# Altium project SmartBuoyLoRa.PrjPCB
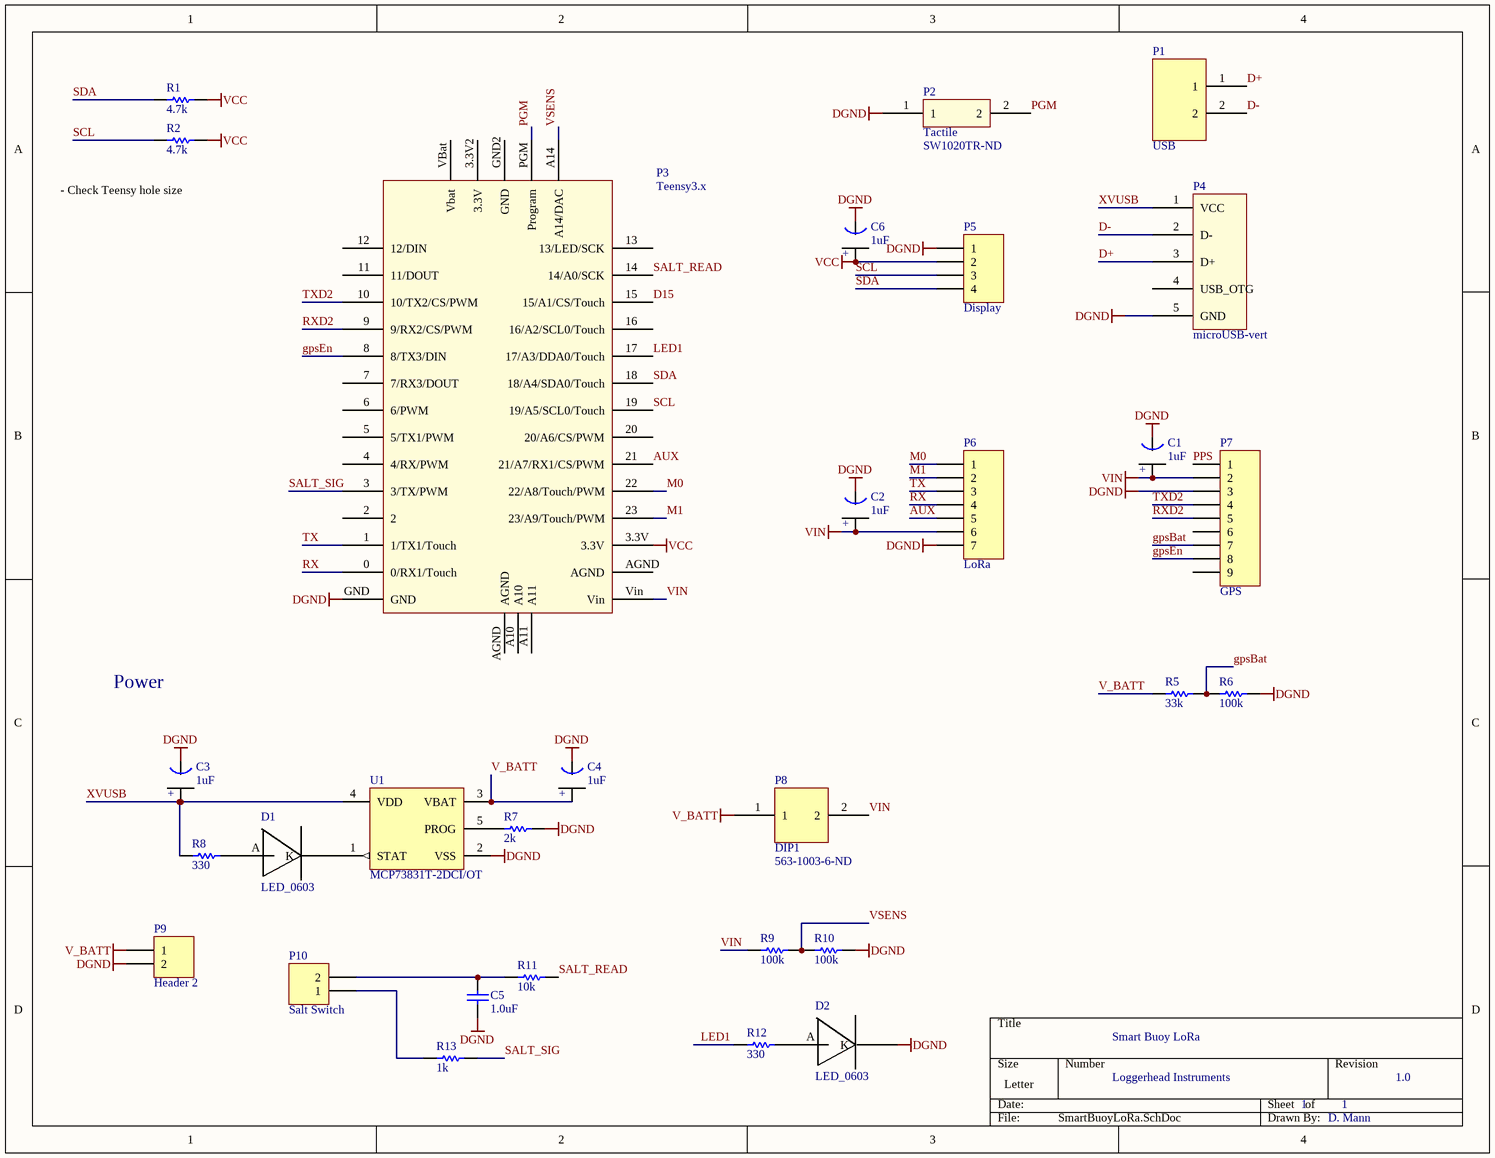
[diagram p0: SmartBuoyLoRa.SchDoc]
1 sheet, 30 parts. Net scope: global (net labels, ports and power ports of the same name join across sheets).
Board file: SmartBuoyLoRa.PcbDoc

## Sheet SmartBuoyLoRa.SchDoc
size Letter

### Parts
C1  1uF  [Tant0805]
C2  1uF  [Tant0805]
C3  1uF  [Tant0805]
C4  1uF  [Tant0805]
C5  1.0uF  [0402]
C6  1uF  [Tant0805]
D1  LED_0603  [Diode0603]
D2  LED_0603  [Diode0603]
P1  USB  [HDR_2x1_2mm]
P2  Tactile  Supplier Part Number 1: SW1020TR-ND  [Tactile-B3U-1000]
P3  Teensy3.x  [Teensy3.x]
P4  microUSB-vert  [MICROUSB-VERT]
P5  Display  [HDR1X4]
P6  LoRa  [HDR1X7]
P7  GPS  [HDR1X9]
P8  DIP1  Supplier Part Number 1: 563-1003-6-ND  [DIP1]
P9  Header 2  [HDR1X2]
P10  Salt Switch  [HDR1X2]
R1  4.7k  [3-0603]
R2  4.7k  [3-0603]
R5  33k  [3-0603]
R6  100k  [3-0603]
R7  2k  [3-0603]
R8  330  [3-0603]
R9  100k  [3-0603]
R10  100k  [3-0603]
R11  10k  [3-0603]
R12  330  [3-0603]
R13  1k  [3-0603]
U1  MCP73831T-2DCI/OT  [SOT-23-OT5_N]

### Nets
DGND: C1.1(GND) C2.1(GND) C3.1(GND) C4.1(GND) C5.2 C6.1(GND) D2.K P2.1 P3.GND P4.5(GND) P5.1 P6.7 P7.3 P9.2 R6.1 R7.1 R10.1 U1.2(VSS)
V_BATT: C4.2(+) P8.1 P9.1 R5.2 U1.3(VBAT)
VCC: C6.2(+) P3.3.3V P5.2 R1.1 R2.2
VIN: C1.2(+) C2.2(+) P3.Vin P6.6 P7.2 P8.2 R9.2
AUX: P3.21(21/A7/RX1/CS/PWM) P6.5
D15: P3.15(15/A1/CS/Touch)
D+: P1.1 P4.3(D+)
D-: P1.2 P4.2(D-)
gpsBat: P7.7 R5.1 R6.2
gpsEn: P3.8(8/TX3/DIN) P7.8
LED1: P3.17(17/A3/DDA0/Touch) R12.1
M0: P3.22(22/A8/Touch/PWM) P6.1
M1: P3.23(23/A9/Touch/PWM) P6.2
PGM: P2.2 P3.PGM(Program)
PPS: P7.1
RX: P3.0(0/RX1/Touch) P6.4
RXD2: P3.9(9/RX2/CS/PWM) P7.5
SALT_READ: P3.14(14/A0/SCK) R11.1
SALT_SIG: P3.3(3/TX/PWM) R13.2
SCL: P3.19(19/A5/SCL0/Touch) P5.3 R2.1
SDA: P3.18(18/A4/SDA0/Touch) P5.4 R1.2
TX: P3.1(1/TX1/Touch) P6.3
TXD2: P3.10(10/TX2/CS/PWM) P7.4
VSENS: P3.A14(A14/DAC) R9.1 R10.2
XVUSB: C3.2(+) P4.1(VCC) R8.1 U1.4(VDD)
NetC5_1: C5.1 P10.2 R11.2
NetD1_A: D1.A R8.2
NetD1_K: D1.K U1.1(STAT)
NetD2_A: D2.A R12.2
NetP10_1: P10.1 R13.1
NetR7_2: R7.2 U1.5(PROG)

Not connected (* = marked no-connect by the designer): P3 2 3.3V2(3.3V) 4(4/RX/PWM) 5(5/TX1/PWM) 6(6/PWM) 7(7/RX3/DOUT) 11(11/DOUT) 12(12/DIN) 13(13/LED/SCK) 16(16/A2/SCL0/Touch) 20(20/A6/CS/PWM) A10 A11 AGND GND2(GND) VBat(Vbat); P4 4(USB_OTG); P7 6 9

### Notes on the sheet
- (near R2) - Check Teensy hole size
- Power
- Smart Buoy LoRa
- Loggerhead Instruments
- 1
- 1.0
- D. Mann

### Library data of the parts
C1-C4 C6 = Tant0805: Value: 1uF
C5 = C0402: Ceramic Chip Capacitor - Standard; Note: Footprint corresponds to dimensions for bulk cassette packaging. This case size has tightened tolerances.; Value: 0.1uF; Published: 17-Jul-2002; LatestRevisionDate: 19-Mar-2004; LatestRevisionNote: Silkscreen size reduced.; DatasheetDocument: Mar-2001; PackageDocument: Mar-2001; PackageReference: 0402; Publisher: Altium Limited; Code_JEITA: 0402; Code_IPC: 1005 [0402]; ComponentLink1Description: Manufacturer Link; ComponentLink1URL: http://www.kemet.com/; ComponentLink2Description: Datasheet; ComponentLink2URL: http://www.kemet.com/kemet/web/homepage/kechome.nsf/vapubfilesname/F3102TA.pdf/$file/F3102TA.pdf
P1 = HDR_2x1_2mm: Charging Connector
P2 = Tactile_B3U-1000: Supplier 1: Digi-Key
P4 = microUSB-vert: Molex 105133-0011
P5 = Header 4: Header, 4-Pin; LatestRevisionDate: 17-Jul-2002; LatestRevisionNote: Re-released for DXP Platform.; Publisher: Altium Limited
P6 = Header 7: Header, 7-Pin; LatestRevisionDate: 17-Jul-2002; LatestRevisionNote: Re-released for DXP Platform.; Publisher: Altium Limited
P7 = Header 9: Header, 9-Pin; LatestRevisionDate: 17-Jul-2002; LatestRevisionNote: Re-released for DXP Platform.; Publisher: Altium Limited
P9 P10 = Header 2: Header, 2-Pin; LatestRevisionDate: 17-Jul-2002; LatestRevisionNote: Re-released for DXP Platform.; Publisher: Altium Limited
R1 R2 R5-R13 = ERJ3RK: Precision Thick Film Chip Resistor, 10 Ohm to 1M Ohm Range, 1% and 0.5% Tolerance, 0603 Size, 0.063 W; Published: 17-Dec-2003; LatestRevisionDate: 19-Mar-2004; LatestRevisionNote: Silkscreen size reduced.; PackageDocument: Mar-2003; PackageReference: 3-0603; Publisher: Altium Limited; Code_IPC: 1608 [0603]; ComponentLink1Description: Manufacturer Link; ComponentLink1URL: http://www.panasonic.com/industrial/components/resistive_products.htm; ComponentLink2Description: Datasheet; ComponentLink2URL: http://www.panasonic.com/industrial/components/pdf/AOA0000CE2.pdf
U1 = MCP73831T-2DCI/OT: Miniature Single-Cell, Fully Integrated Li-Ion, Li-Polymer Charge Management Controller, 4.2V, 5-Pin SOT-23, Industrial Temperature, Tape and Reel; DatasheetVersion: revE, Sep-2008; PackageVersion: revBB, Aug-2009; PackageReference: SOT-23-OT5; PackageDescription: 5-Lead Plastic Small Outline Transistor (OT) [SOT-23]; Code_IPC: SOT23-5; ComponentLink1Description: Manufacturer URL; ComponentLink1URL: http://www.microchip.com/; ComponentLink2Description: Datasheet; ComponentLink2URL: http://ww1.microchip.com/downloads/en/DeviceDoc/21984e.pdf; ComponentLink3Description: Package Specification; ComponentLink3URL: http://www.microchip.com/stellent/groups/techpub_sg/documents/packagingspec/en012702.pdf
P8 = DIP1: Supplier 1: Digi-Key